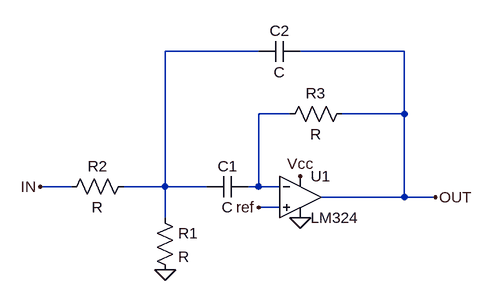
[diagram p0: schematic MFB_topology.asc]
MFB_topology.asc, the LTspice schematic file:
Version 4
SHEET 1 880 680
WIRE 128 -80 -16 -80
WIRE 352 -80 192 -80
WIRE 176 16 128 16
WIRE 352 16 352 -80
WIRE 352 16 256 16
WIRE -160 128 -208 128
WIRE -16 128 -16 -80
WIRE -16 128 -80 128
WIRE 48 128 -16 128
WIRE 128 128 128 16
WIRE 128 128 112 128
WIRE 160 128 128 128
WIRE 352 144 352 16
WIRE 352 144 224 144
WIRE 400 144 352 144
WIRE 160 160 128 160
WIRE -16 176 -16 128
FLAG 192 112 Vcc
FLAG 192 176 0
FLAG 400 144 OUT
FLAG -208 128 IN
FLAG -16 256 0
FLAG 128 160 ref
SYMBOL OpAmps\\opamp2 192 80 R0
SYMATTR InstName U1
SYMATTR Value LM324
SYMBOL cap 112 112 R90
WINDOW 0 0 32 VBottom 2
WINDOW 3 32 32 VTop 2
SYMATTR InstName C1
SYMBOL cap 192 -96 R90
WINDOW 0 0 32 VBottom 2
WINDOW 3 32 32 VTop 2
SYMATTR InstName C2
SYMBOL res -32 160 R0
SYMATTR InstName R1
SYMBOL res -64 112 R90
WINDOW 0 0 56 VBottom 2
WINDOW 3 32 56 VTop 2
SYMATTR InstName R2
SYMBOL res 272 0 R90
WINDOW 0 0 56 VBottom 2
WINDOW 3 32 56 VTop 2
SYMATTR InstName R3

The netlist it stands for:
* MFB_topology.asc
XU1 ref N002 Vcc 0 OUT LM324  ; pins In+ In- V+ V- OUT
C1 N002 N001 C
C2 OUT N001 C
R1 N001 0 R
R2 N001 IN R
R3 OUT N002 R
.backanno
.end